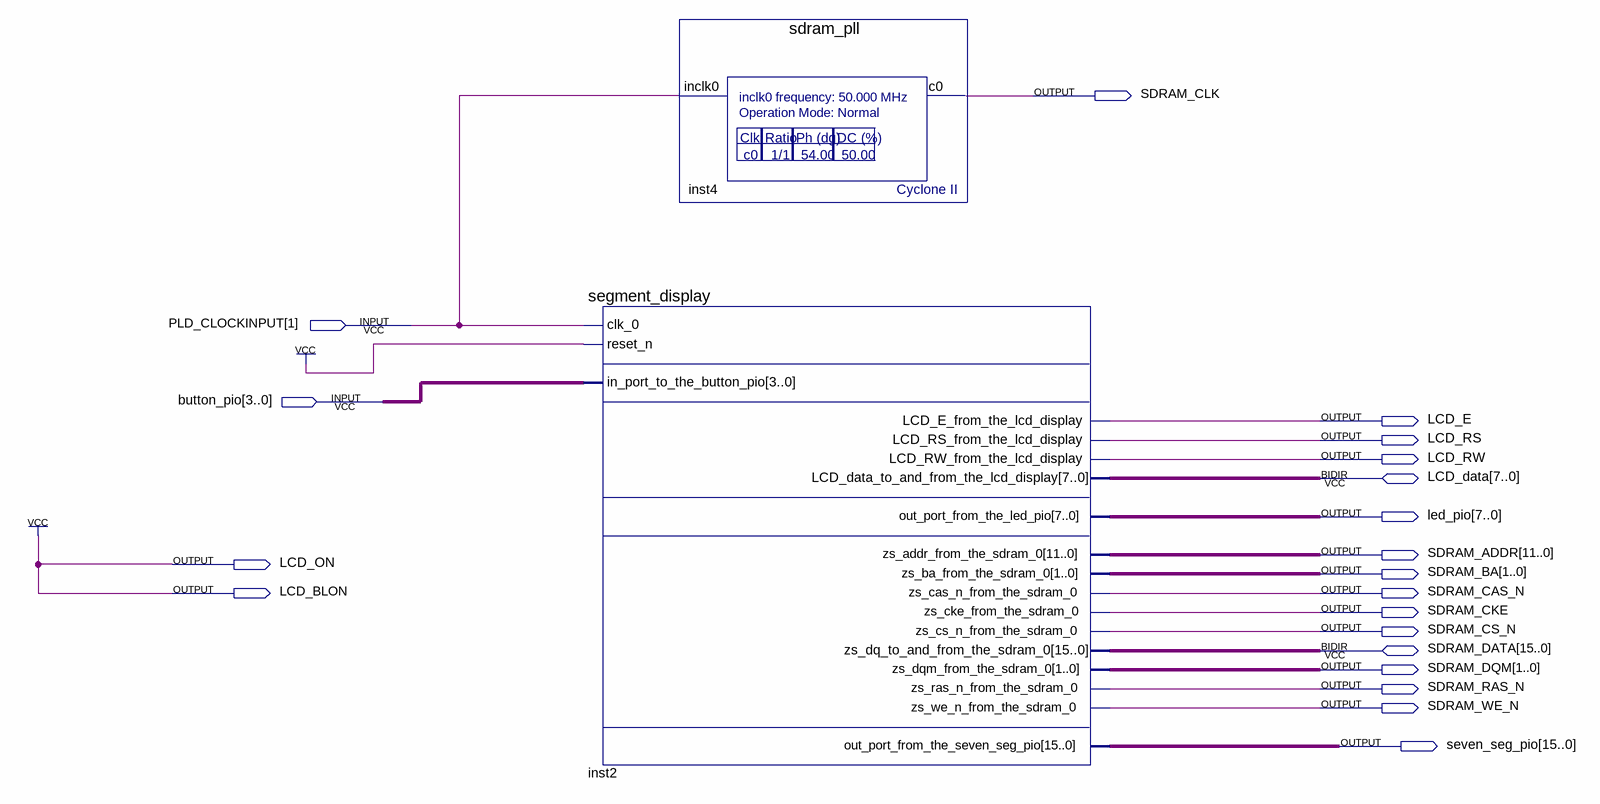
[diagram p0: schematic sheet]
// Quartus schematic lab_4.bdf as structural Verilog: 2 symbols, 20 pins
module lab_4 (
  input  [1:1] PLD_CLOCKINPUT,
  input  [3:0] button_pio,
  inout  [7:0] LCD_data,
  inout  [15:0] SDRAM_DATA,
  output SDRAM_CLK,
  output LCD_E,
  output LCD_RS,
  output LCD_RW,
  output [7:0] led_pio,
  output [11:0] SDRAM_ADDR,
  output LCD_ON,
  output [1:0] SDRAM_BA,
  output LCD_BLON,
  output SDRAM_CAS_N,
  output SDRAM_CKE,
  output SDRAM_CS_N,
  output [1:0] SDRAM_DQM,
  output SDRAM_RAS_N,
  output SDRAM_WE_N,
  output [15:0] seven_seg_pio
);

  segment_display inst2 (
    .clk_0(PLD_CLOCKINPUT[1]), .reset_n(1'b1), .in_port_to_the_button_pio(button_pio),
    .LCD_E_from_the_lcd_display(LCD_E), .LCD_RS_from_the_lcd_display(LCD_RS),
    .LCD_RW_from_the_lcd_display(LCD_RW), .out_port_from_the_led_pio(led_pio),
    .zs_addr_from_the_sdram_0(SDRAM_ADDR), .zs_ba_from_the_sdram_0(SDRAM_BA),
    .zs_cas_n_from_the_sdram_0(SDRAM_CAS_N), .zs_cke_from_the_sdram_0(SDRAM_CKE),
    .zs_cs_n_from_the_sdram_0(SDRAM_CS_N), .zs_dqm_from_the_sdram_0(SDRAM_DQM),
    .zs_ras_n_from_the_sdram_0(SDRAM_RAS_N), .zs_we_n_from_the_sdram_0(SDRAM_WE_N),
    .out_port_from_the_seven_seg_pio(seven_seg_pio), .LCD_data_to_and_from_the_lcd_display(LCD_data),
    .zs_dq_to_and_from_the_sdram_0(SDRAM_DATA));
  sdram_pll inst4 (.inclk0(PLD_CLOCKINPUT[1]), .c0(SDRAM_CLK));

  assign LCD_BLON = 1'b1;
  assign LCD_ON = 1'b1;
endmodule
